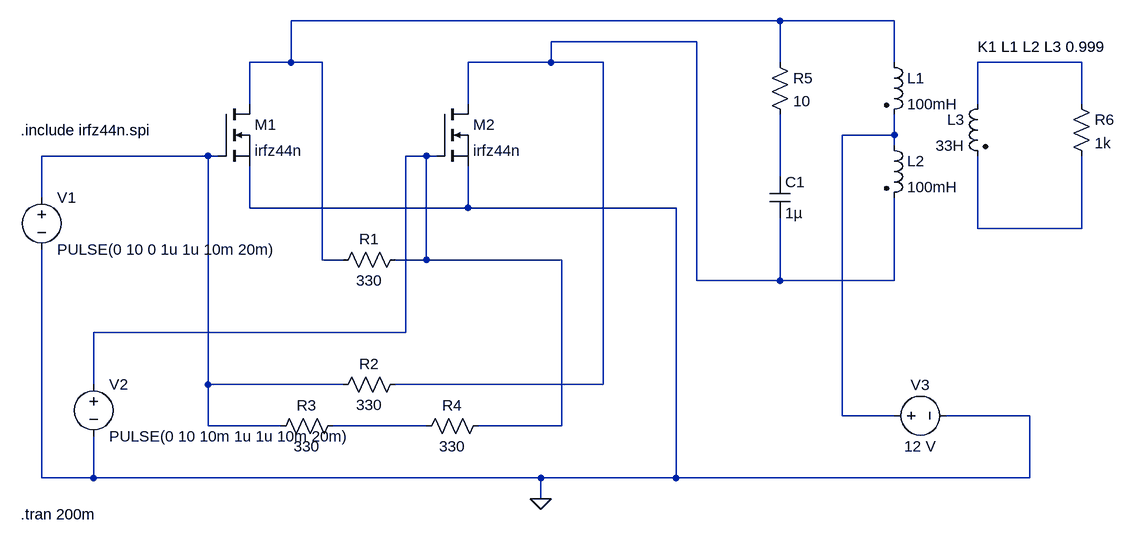
[diagram p0: schematic 12V_DC_220V_AC_CONV.asc]
12V_DC_220V_AC_CONV.asc, the LTspice schematic file:
Version 4
SHEET 1 1448 984
WIRE 928 -16 176 -16
WIRE 1104 -16 928 -16
WIRE 800 16 576 16
WIRE 176 48 176 -16
WIRE 176 48 112 48
WIRE 224 48 176 48
WIRE 576 48 576 16
WIRE 576 48 448 48
WIRE 656 48 576 48
WIRE 928 48 928 -16
WIRE 1104 48 1104 -16
WIRE 1392 48 1232 48
WIRE 112 112 112 48
WIRE 448 112 448 48
WIRE 1232 112 1232 48
WIRE 1392 112 1392 48
WIRE 1104 160 1104 128
WIRE 1104 160 1024 160
WIRE 1104 176 1104 160
WIRE 48 192 -208 192
WIRE 64 192 48 192
WIRE 384 192 352 192
WIRE 400 192 384 192
WIRE 928 224 928 128
WIRE -208 256 -208 192
WIRE 112 272 112 208
WIRE 448 272 448 208
WIRE 448 272 112 272
WIRE 768 272 448 272
WIRE 1232 304 1232 192
WIRE 1392 304 1392 192
WIRE 1392 304 1232 304
WIRE 224 352 224 48
WIRE 256 352 224 352
WIRE 384 352 384 192
WIRE 384 352 336 352
WIRE 592 352 384 352
WIRE 800 384 800 16
WIRE 928 384 928 288
WIRE 928 384 800 384
WIRE 1104 384 1104 256
WIRE 1104 384 928 384
WIRE 352 464 352 192
WIRE 352 464 -128 464
WIRE -128 544 -128 464
WIRE 48 544 48 192
WIRE 256 544 48 544
WIRE 656 544 656 48
WIRE 656 544 336 544
WIRE 1024 592 1024 160
WIRE 1104 592 1024 592
WIRE 1312 592 1184 592
WIRE 48 608 48 544
WIRE 160 608 48 608
WIRE 384 608 240 608
WIRE 592 608 592 352
WIRE 592 608 464 608
WIRE -208 688 -208 336
WIRE -128 688 -128 624
WIRE -128 688 -208 688
WIRE 560 688 -128 688
WIRE 768 688 768 272
WIRE 768 688 560 688
WIRE 1312 688 1312 592
WIRE 1312 688 768 688
WIRE 560 720 560 688
FLAG 560 720 0
SYMBOL nmos 64 112 R0
SYMATTR InstName M1
SYMATTR Value irfz44n
SYMBOL nmos 400 112 R0
SYMATTR InstName M2
SYMATTR Value irfz44n
SYMBOL voltage -208 240 R0
WINDOW 123 0 0 Left 0
WINDOW 39 0 0 Left 0
SYMATTR InstName V1
SYMATTR Value PULSE(0 10 0 1u 1u 10m 20m)
SYMBOL voltage -128 528 R0
WINDOW 123 0 0 Left 0
WINDOW 39 0 0 Left 0
SYMATTR InstName V2
SYMATTR Value PULSE(0 10 10m 1u 1u 10m 20m)
SYMBOL res 352 336 R90
WINDOW 0 0 56 VBottom 2
WINDOW 3 32 56 VTop 2
SYMATTR InstName R1
SYMATTR Value 330
SYMBOL res 352 528 R90
WINDOW 0 0 56 VBottom 2
WINDOW 3 32 56 VTop 2
SYMATTR InstName R2
SYMATTR Value 330
SYMBOL res 256 592 R90
WINDOW 0 0 56 VBottom 2
WINDOW 3 32 56 VTop 2
SYMATTR InstName R3
SYMATTR Value 330
SYMBOL res 480 592 R90
WINDOW 0 0 56 VBottom 2
WINDOW 3 32 56 VTop 2
SYMATTR InstName R4
SYMATTR Value 330
SYMBOL voltage 1088 592 R270
WINDOW 0 32 56 VTop 2
WINDOW 3 -32 56 VBottom 2
WINDOW 123 0 0 Left 0
WINDOW 39 0 0 Left 0
SYMATTR InstName V3
SYMATTR Value 12 V
SYMBOL res 912 32 R0
SYMATTR InstName R5
SYMATTR Value 10
SYMBOL cap 912 224 R0
SYMATTR InstName C1
SYMATTR Value 1µ
SYMBOL ind2 1088 32 R0
SYMATTR InstName L1
SYMATTR Value 100mH
SYMATTR Type ind
SYMBOL ind2 1088 160 R0
SYMATTR InstName L2
SYMATTR Value 100mH
SYMATTR Type ind
SYMBOL ind2 1248 96 M0
SYMATTR InstName L3
SYMATTR Value 33H
SYMATTR Type ind
SYMBOL res 1376 96 R0
SYMATTR InstName R6
SYMATTR Value 1k
TEXT -240 152 Left 2 !.include irfz44n.spi
TEXT 1232 24 Left 2 !K1 L1 L2 L3 0.999
TEXT -240 744 Left 2 !.tran 200m

The netlist it stands for:
* 12V_DC_220V_AC_CONV.asc
M1 N001 N005 0 0 irfz44n
M2 N002 N006 0 0 irfz44n
V1 N005 0 PULSE(0 10 0 1u 1u 10m 20m)
V2 N006 0 PULSE(0 10 10m 1u 1u 10m 20m)
R1 N006 N001 330
R2 N002 N005 330
R3 N009 N005 330
R4 N006 N009 330
V3 N004 0 12 V
R5 N001 N007 10
C1 N007 N002 1µ
L1 N001 N004 100mH
L2 N004 N002 100mH
L3 N003 N008 33H
R6 N003 N008 1k
.model NMOS NMOS
.model PMOS PMOS
.lib standard.mos
.include irfz44n.spi
K1 L1 L2 L3 0.999
.tran 200m
.backanno
.end